# EAGLE design sensor_v0.2 (EAGLE 7.7.0)

## Sheet 1 of 2
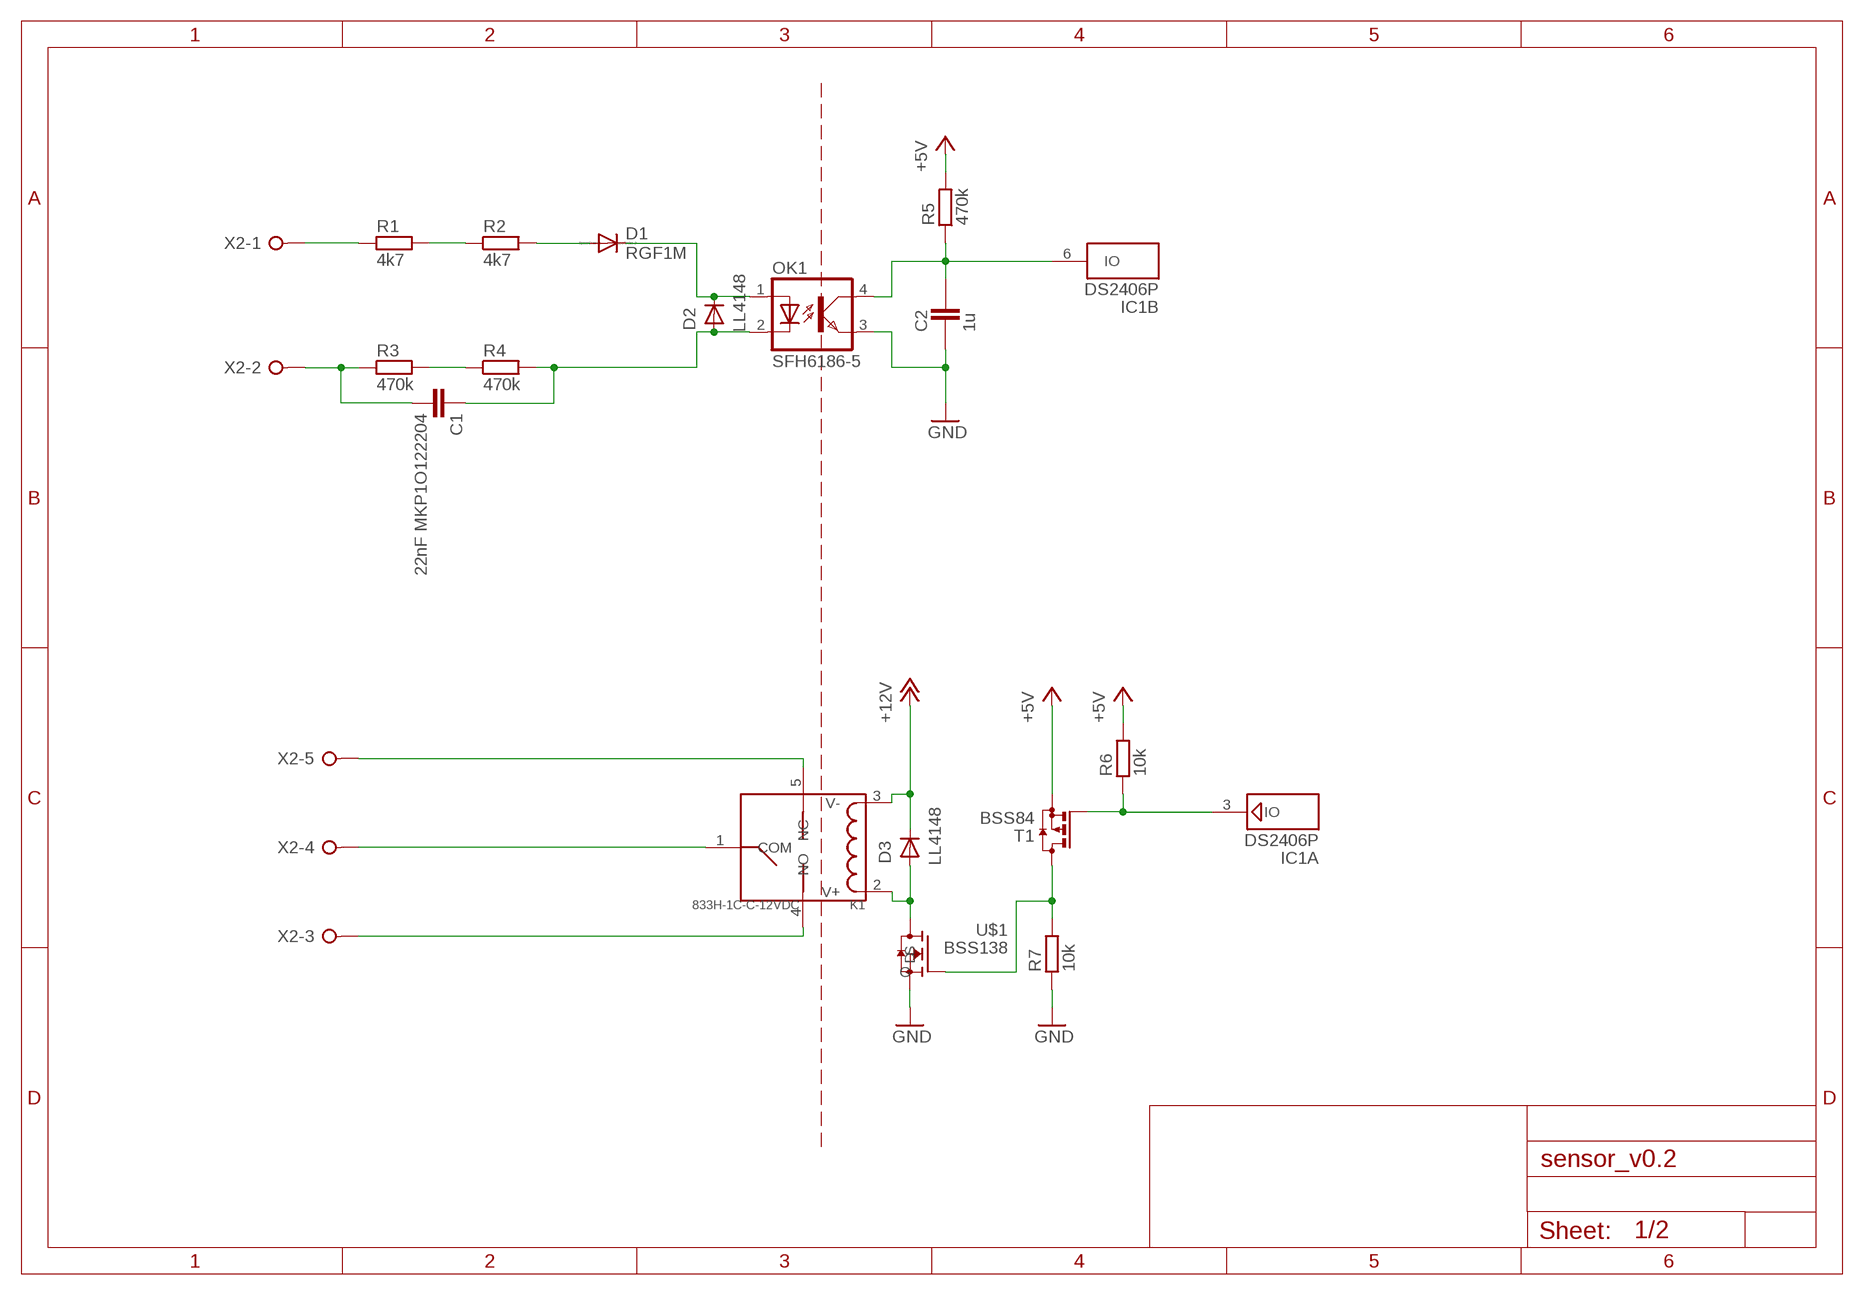
[diagram p0: schematic, sheet 1]

### Parts
C1  22nF MKP1O122204  C-EU150-064X183  [C150-064X183]
C2  1u  CAPACITOR_0603  [CAPC1608X92N]
D1  RGF1M  DIODE-DO214BA  [DO214BA]
D2  LL4148  PMLL4148L  [SOD80C]
D3  LL4148  PMLL4148L  [SOD80C]
IC1  DS2406P  [TSOC6]
K1  833H-1C-C-12VDC  RELAY-HLS8L-DC3V-S-C(5P-19X15MM)  [REY5-19.0X15.0X15.0MM]
OK1  SFH6186-5  [SMD4]
R1  4k7  RESISTOR_2512  [RESC6432X70N]
R2  4k7  RESISTOR_2512  [RESC6432X70N]
R3  470k  RESISTOR_2512  [RESC6432X70N]
R4  470k  RESISTOR_2512  [RESC6432X70N]
R5  470k  RESISTOR_0402  [RESC1005X40AN]
R6  10k  RESISTOR_0402  [RESC1005X40AN]
R7  10k  RESISTOR_0402  [RESC1005X40AN]
T1  BSS84  [SOT23]
U$1  BSS138  [BSS138]
X2  W237-05P  [W237-5P]

### Nets
!EN: IC1.3(A:IO) R6.1 T1.1(G)
!PWR: C2.2 IC1.6(B:IO) OK1.4(COL) R5.1
+5V: R5.2 R6.2 T1.2(S) ; also sheet 2
+12V: D3.1(K) K1.3(V-) ; also sheet 2
GND: C2.1 OK1.3(EMIT) R7.1 U$1.S ; also sheet 2
N$1: R1.1 X2.1
N$2: R1.2 R2.1
N$3: R3.2 R4.1
N$4: C1.2 R3.1 X2.2
N$5: D1.A R2.2
N$6: C1.1 D2.2(A) OK1.2(C) R4.2
N$7: D1.C D2.1(K) OK1.1(A)
N$8: K1.1(COM) X2.4
N$9: K1.5(NC) X2.5
N$10: K1.4(NO) X2.3
N$12: R7.2 T1.3(D) U$1.G
N$13: D3.2(A) K1.2(V+) U$1.D

## Sheet 2 of 2
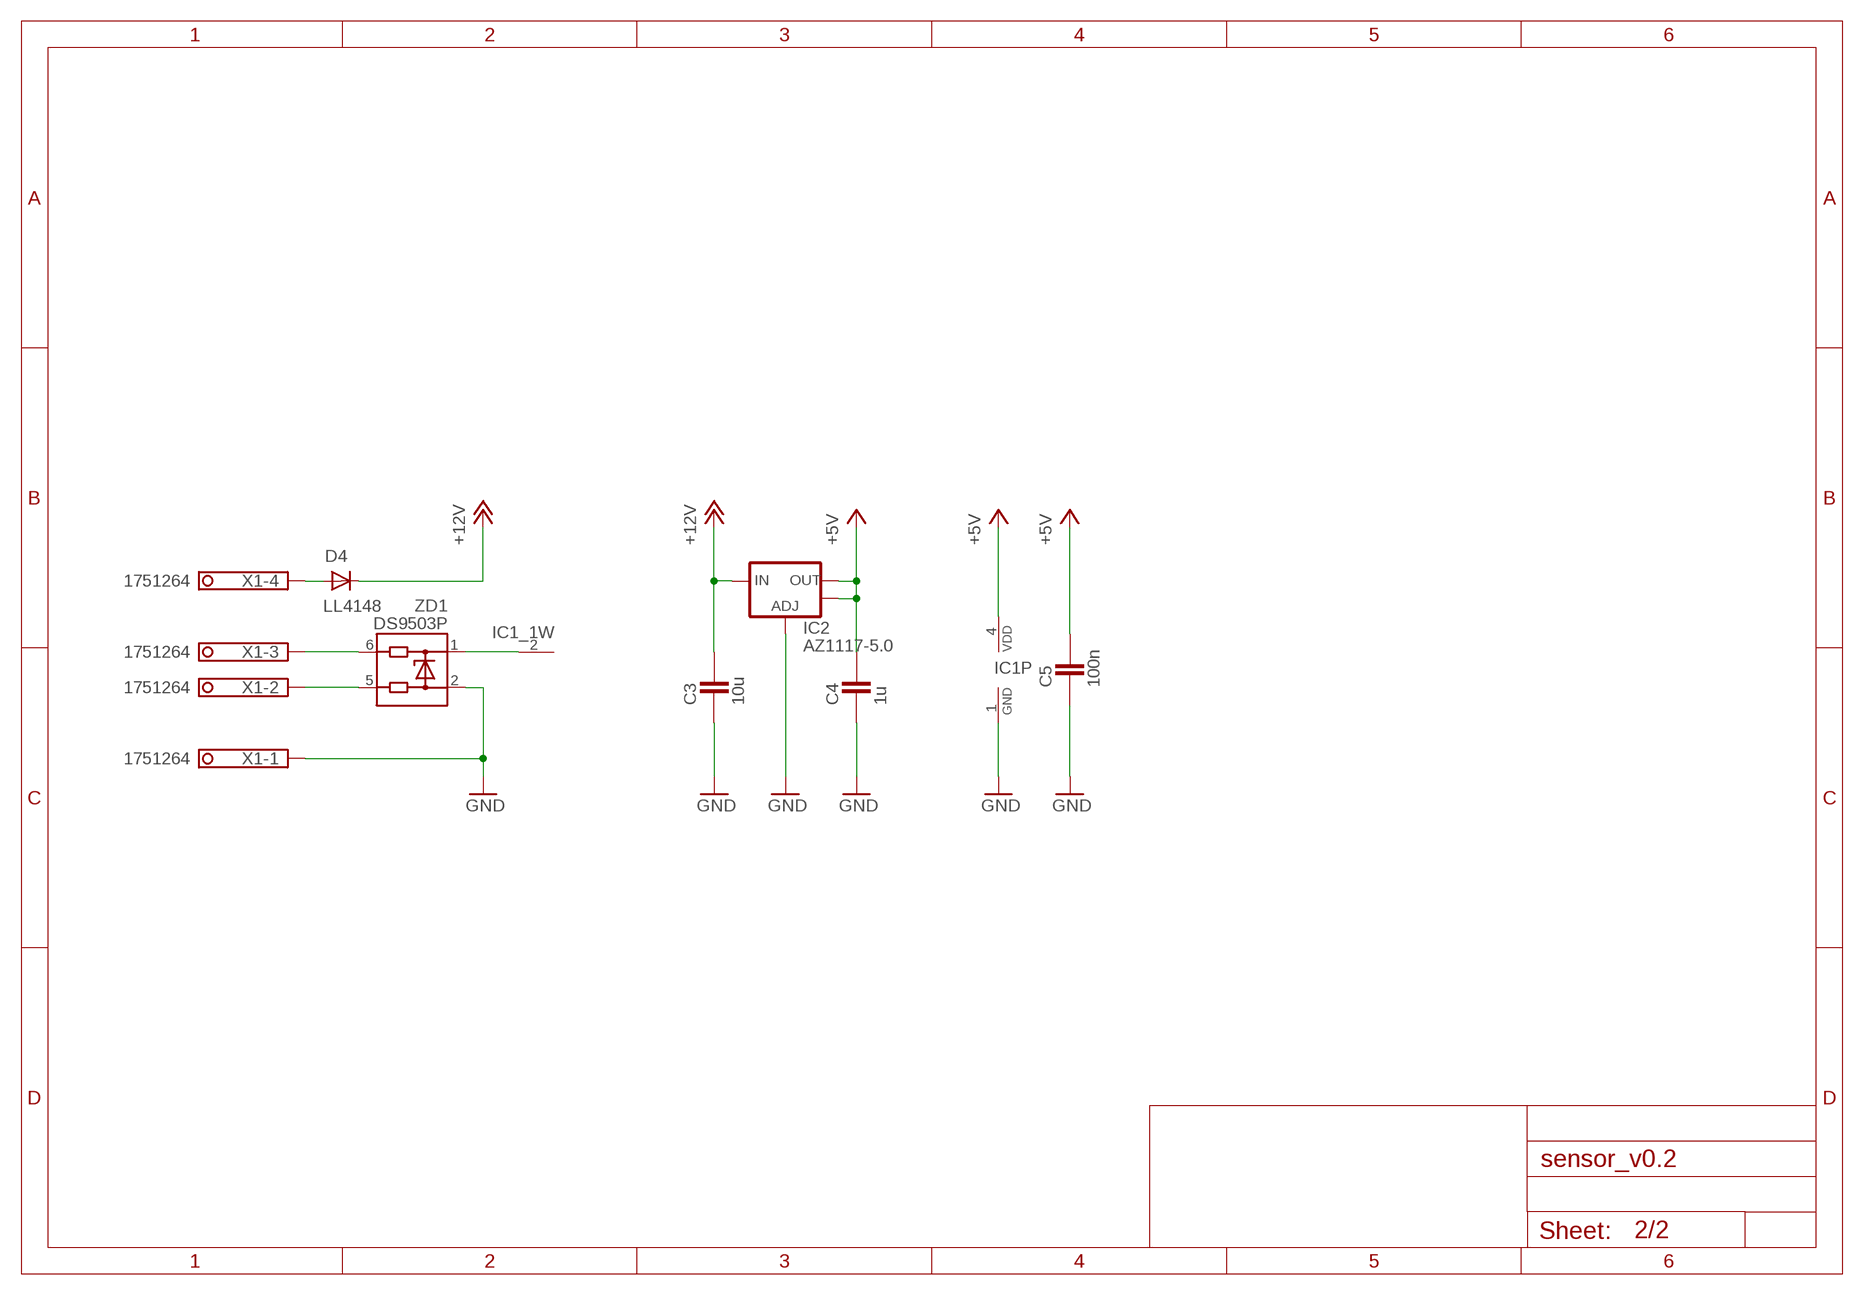
[diagram p1: schematic, sheet 2]

### Parts
C3  10u  CAPACITOR_0805  [CAPC2012X145AN]
C4  1u  CAPACITOR_0603  [CAPC1608X92N]
C5  100n  CAPACITOR_0402  [CAPC1005X60N]
D4  LL4148  PMLL4148L  [SOD80C]
IC2  AZ1117-5.0  V_REG_LM1117SOT223  [SOT223]
X1  1751264  [1751264]
ZD1  DS9503P  [TSOC6]

### Nets
1W: IC1.2(_1W:1W) ZD1.1
+5V: C4.2 C5.2 IC1.4(P:VDD) IC2.2(OUT) IC2.4(OUT) ; also sheet 1
+12V: C3.2 D4.1(K) IC2.3(IN) ; also sheet 1
GND: C3.1 C4.1 C5.1 IC1.1(P:GND) IC2.1(ADJ) X1.1 ZD1.2 ; also sheet 1
N$11: X1.2 ZD1.5
N$14: X1.3 ZD1.6
N$16: D4.2(A) X1.4

## Library data of the parts
C1 = rcl:C-EU: CAPACITOR, European symbol
C2-C5 = ipc-7351-capacitor:CAPACITOR_
D1 = diode:DIODE-: DIODE
D2-D4 = nxp_60:PMLL4148L: Single high-speed switching diodes, fabricated in planar technology, and encapsulated in small hermetically sealed glass SOD80C Surface-Mounted Device (SMD) packages. AAL Eindhoven MK; FARNELL: 1097176
IC1 = 1wire:DS2406P: Dual Addressable Switch Plus 1024-Bit EPROM This chip provides one open drain I/O pin (PA) with 50mA sinking capability and a second open drain I/O pin (PB) with 8mA sinking capability. Each I/O pin also feature an edge detector which is set by any level change on the input and reset by software. The EPROM has 4 pages of 256 bit with sparate write protection. Notes: 12V must be applied to the 1W pin in a controlled fashion to program the EPROM. This is handled by e.g. the DS2480B host adapter chip automatically. Vdd@5V may be used to save the current chip state whenever parasitic power over the 1W pin is lost. Vdd is no Vpp pin! Never connect 12V to Vdd. The DS2406 is the same chip in a TO-92 package with 3 pins only, thus missing the PB and Vdd features. Author: Jan Kandziora <jjj@gmx.de>
IC2 = SparkFun:V_REG_LM1117: Voltage Regulator LM1117 Standard adjustable voltage regulator but in SMD form. Spark Fun Electronics SKU : COM-00595
K1 = Seeed-OPL-Relay:RELAY-HLS8L-DC3V-S-C(5P-19X15MM): 315030009; MPN: HLS8L-DC3V-S-C
OK1 = optocoupler:SFH618?*: Optocoupler, Phototransistor Output, Low Input Current Source: http://www.vishay.com/docs/83673/sfh618.pdf
R1-R7 = ipc-7351-resistor:RESISTOR_
T1 = mbed-discrete:BSS84: P-CHANNEL MOS FET
U$1 = Ava:BSS138: BSS138 N-Channel Logic Level Enhancement Mode Field Effect Transistor
X1 = con-phoenix-350:1751264: MKDS 1/ 4-3,5 Printklemme Nennstrom: 10 A Bemessungsspannung: 160 V Raster: 3,5 mm Polzahl: 4 Montageart: Löten Anschlussart: Schraubanschluss Anschlussrichtung vom Leiter zur Platine: 0° Source: http://eshop.phoenixcontact.com .. 1751264.pdf; MPN: 1751264; OC_FARNELL: unknown; OC_NEWARK: 10R0934
X2 = con-wago-508:W237-05P: WAGO SREW CLAMP; OC_FARNELL: unknown; OC_NEWARK: unknown
ZD1 = 1wire:DS9503: ESD Protection Diode with Resistors This ESD protection diode is designed especially for onewire host interfaces. Unlike the DS9502, it has two additional 5Ohm resitors in the 1W and GND line. Pin 5 and 6 have to be connected to the host side, pin 1 und 2 to the network side. The 1W line is through pin 1 and 6, the GND line is through pin 2 and 5. Author: Jan Kandziora <jjj@gmx.de>

## Board
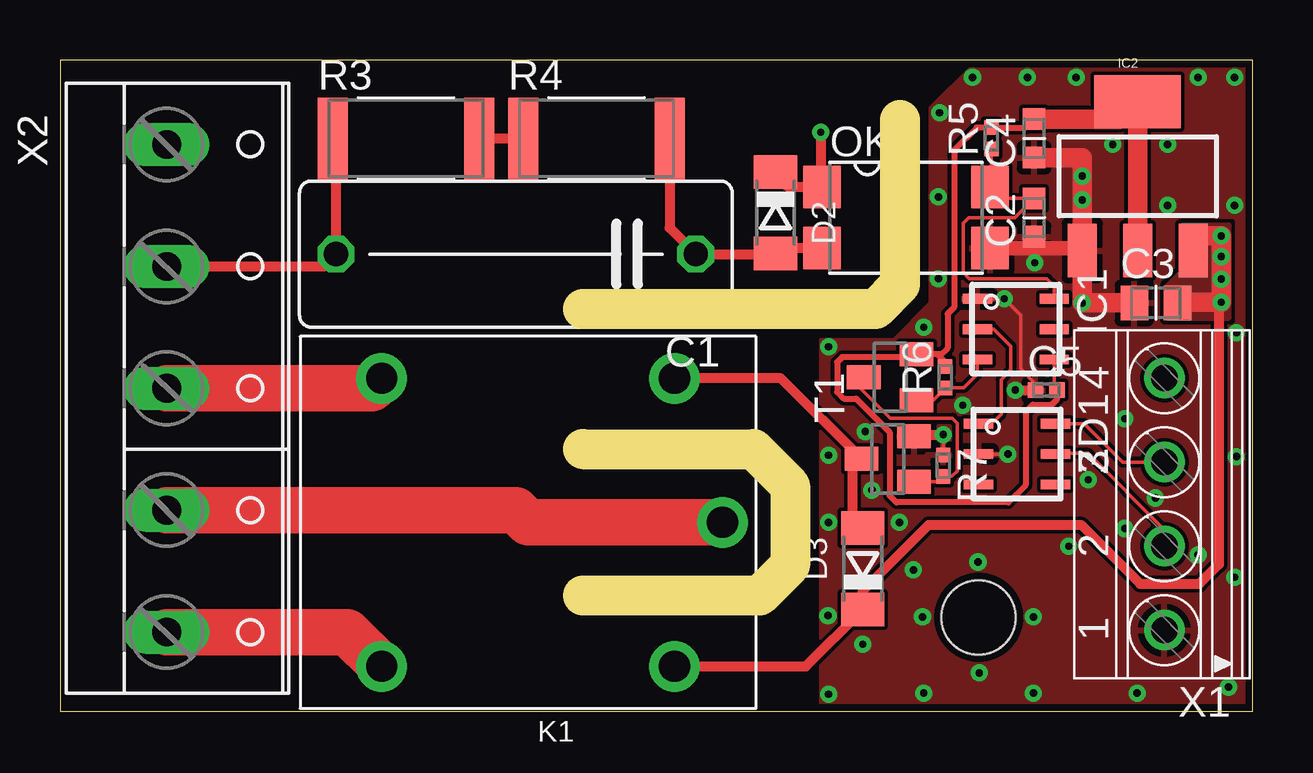
[diagram p2: board, top side]
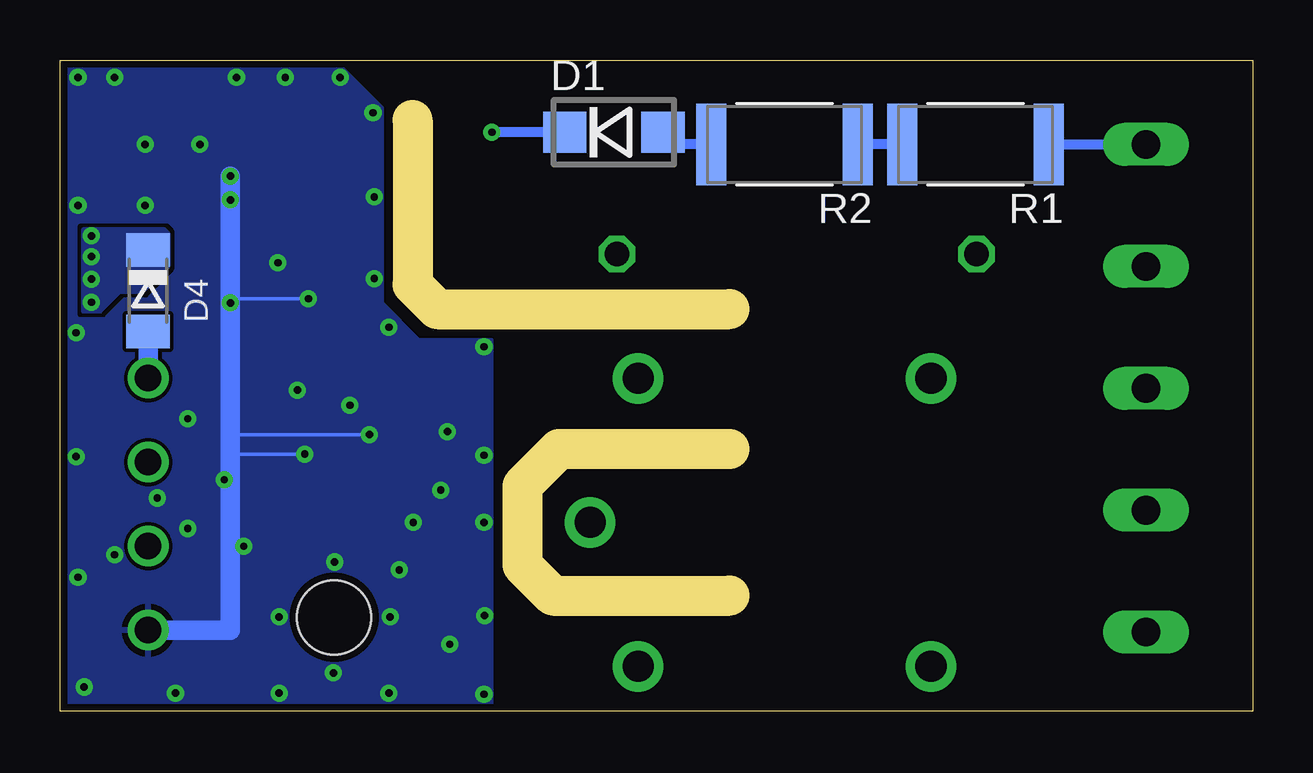
[diagram p3: board, bottom side, seen from below]

Size 49.69 x 27.14 mm. Coordinates in mm from the lower left corner, seen from the top.
Outline: 0,0 49.69,0 49.69,27.14 0,27.14 0,0
Copper layers (1*16): Top 0.035mm / dielectric 1.5mm / Bottom 0.035mm
Design rules "default *": minimum track width 6mil, minimum drill 12mil, track to track 6mil, track to pad 6mil, pad to pad 6mil, via to via 6mil, smd to smd 6mil, copper to edge 12mil, drill to drill 8mil, minimum pad ring 10mil, minimum via ring 8mil, stop-mask expansion 4mil, vias tented up to drill 20mil, thermal gap 10mil
Holes 3.1 mm at 38.27,3.91
Milling: 8 lines

### Footprints (pad centres in the part's own frame; a part is rotated, then mirrored left to right if it is on the bottom)
C150-064X183 = drill 1.016 octagon: 1 -7.493,0; 2 7.493,0
CAPC1608X92N = smd 0.9 x 0.95: 1 -0.8,0; 2 0.8,0
CAPC2012X145AN = smd 1.15 x 1.45: 1 -0.9,0; 2 0.9,0
CAPC1005X60N = smd 0.65 x 0.65: 1 -0.45,0; 2 0.45,0
DO214BA = smd 1.8 x 1.7: A 2.05,0; C -2.05,0
SOD80C = smd 1.4 x 1.8: 1 -1.7,0; 2 1.7,0
TSOC6 = smd 0.406 x 1.219: 1 -1.27,-1.6; 2 0,-1.6; 3 1.27,-1.6; 4 1.27,1.6; 5 0,1.6; 6 -1.27,1.6
SOT223 = smd 1.219 x 2.235: 1 -2.311,-3.099; 2 0,-3.099; 3 2.311,-3.099 | smd 3.6 x 2.2: 4 0,3.099
REY5-19.0X15.0X15.0MM = drill 1.3 pad 2.1: 1 -8.1,0; 2 -6.1,-6; 3 -6.1,6; 4 6.1,-6; 5 6.1,6
SMD4 = smd 1.78 x 1.55: 1 -1.27,-3.5; 2 1.27,-3.5; 3 1.27,3.5; 4 -1.27,3.5
RESC6432X70N = smd 1.25 x 3.4: 1 -3.05,0; 2 3.05,0
RESC1005X40AN = smd 0.6 x 0.6: 1 -0.45,0; 2 0.45,0
SOT23 = smd 1 x 1.4: 1 -0.95,-1.1; 2 0.95,-1.1; 3 0,1.1
BSS138 = smd 1 x 1.4: D 0,1.1; G -0.95,-1.1; S 0.95,-1.1
1751264 = drill 1.1 pad 1.7: 1 -5.25,-0.1; 2 -1.75,-0.1; 3 1.75,-0.1; 4 5.25,-0.1
W237-5P = drill 1.194 long: 1 -10.16,-0.635; 2 -5.08,-0.635; 3 0,-0.635; 4 5.08,-0.635; 5 10.16,-0.635

### Placement (x,y rotation side)
C1  19,19.05 180 top
C2  40.59,20.57 90 top
C3  45.67,17.02 0 top
C4  40.59,23.88 90 top
C5  41.09,13.39 0 top
D1  26.62,24.13 0 bottom
D2  29.82,20.78 270 top
D3  33.45,5.94 90 top
D4  46.02,17.53 270 bottom
IC1  39.82,15.93 270 top
IC2  44.9,22.3 0 top
K1  19.5,7.87 180 top
OK1  35.25,20.57 270 top
R1  11.55,23.62 180 bottom
R2  19.5,23.62 180 bottom
R3  14.42,23.88 0 top
R4  22.35,23.88 0 top
R5  38.81,23.88 90 top
R6  36.88,13.92 90 top
R7  36.8,10.24 270 top
T1  34.59,13.92 90 top
U$1  34.49,10.52 90 top
X1  45.92,8.64 90 top
X2  5.08,13.46 270 top
ZD1  39.87,10.72 270 top

### Tracks (layer width: path | path; a pad name or v marks a point on that pad's centre or on a via)
1W
  Top 0.152: IC1.2 38.91,15.93 39.62,15.21 39.62,14.22 39.21,13.82 39.21,12.37 38.94,12.09 ZD1.1
!EN
  Top 0.152: IC1.3 38.22,14.05 37.67,13.49 36.79,13.49 R6.1 36.38,12.97 T1.1
!PWR
  Top 0.152: IC1.6 41.42,17.73 41.12,18.03 37.89,18.03 37.64,18.29 37.64,20.34 37.87,20.57 39.79,20.57 C2.2 39.22,21.37 OK1.4 38.81,21.9 R5.1
+5V
  Top 0.152: IC1.4 41.42,13.51 C5.2
  Top 0.254: C5.2 41.54,13 41.32,12.78 40.54,12.78 40.23,12.47 40.23,9.42 39.52,8.71 34.85,8.71 34.57,8.99 34.57,11.63 33.17,13.03 32.66,13.03 32.38,13.31 32.38,14.55 32.59,14.76 35.48,14.76 T1.2 | 35.74,14.87 T1.2 | C4.2 40.24,24.33 R5.2 38.19,24.33 37.26,23.39 37.26,16.84 36.98,16.56 36.98,15.14 36.67,14.83 36.67,14.84 36.71,14.87 36.55,14.87 | R6.2 36.88,14.55 36.55,14.87 | 36.55,14.87 T1.2
  Top 0.813: IC2.2 IC2.4 44.13,24.68 C4.2
+12V  (via drill 0.3)
  Top 0.406: C3.2 48.28,17.02 48.28,6.12 47.47,5.31 45.01,5.31 42.54,7.77 36.19,7.77 33.45,5.03 D3.1 31.08,1.87 K1.3
  Top 0.813: C3.2 46.59,17.04 v48.38,17.04 v48.38,19.81 47.22,19.81 IC2.3
  Bottom 0.813: D4.1 46.02,19.08
  other vias: 48.38,18.95 48.38,18.01
  pour Top (no thermals): 46.78,20.24 46.78,18.34 46.12,17.68 46.12,16.41 48.69,16.41 48.69,20.24
  pour Bottom (no thermals): 45.21,19.89 45.21,18.57 45.56,18.21 46.28,17.5 47.24,17.5 48.05,16.69 48.69,16.69 48.69,20.07 47.01,20.07 45.39,20.07
GND  (via drill 0.3)
  Top 0.152: IC1.1 v39.34,17.2 40.03,16.51 40.03,14.28 40.64,13.66 C5.1 | ZD1.2 v39.49,10.72 | R7.1 v36.8,11.53
  Top 0.406: U$1.S 35.94,11.53 v36.8,11.53 | v39.8,13.39 C5.1
  Top 0.61: OK1.3 40.69,19.3 | 40.69,19.3 42.54,19.3 | 40.59,19.41 40.69,19.3
  Top 0.813: C3.1 v42.59,17.02 IC2.1 | C4.1 42.59,23.08 v42.59,22.3 v42.59,21.31 IC2.1 | 42.54,19.3 IC2.1 | C2.1 40.59,19.41
  Bottom 0.152: v39.34,17.2 42.42,17.2 v42.59,17.02 | v39.49,10.72 42.52,10.72 42.59,10.74 | v36.8,11.53 42.54,11.53 42.59,11.58
  Bottom 0.813: X1.1 42.59,3.39 42.59,10.74 42.59,11.58 v42.59,17.02 v42.59,22.3
  other vias: 35.99,16 42.34,26.42 38.02,26.42 36.65,24.94 36.6,21.44 36.6,18.03 40.31,26.42 47.42,26.42 48.94,26.42 48.94,21.08 46.15,21.08 46.15,23.62 43.86,23.62 40.56,0.76 42.03,6.88 48.69,1.02 44.88,0.76 48.94,5.59 49.02,15.77 45.64,8.89 44.37,12.19 32.03,0.71 35.99,0.76 33.45,2.79 32,3.99 32.03,10.67 32.03,7.87 32.03,15.19 44.37,7.62 34.97,7.87 42.85,9.65 49.02,10.62 33.55,11.66 33.83,9.22 35.56,5.89 38.25,6.22 40.56,3.94 38.3,1.6 35.94,3.94 47.42,6.53 40.61,18.69 37.61,12.75
  pour Top (rank 6): 38.05,26.92 36.27,25.15 36.27,17.02 34.74,15.49 31.7,15.49 31.7,0.25 49.48,0.25 49.48,26.92
  pour Bottom (rank 6): 36.27,25.15 36.27,17.02 34.74,15.49 31.7,15.49 31.7,0.25 49.48,0.25 49.48,26.92 38.05,26.92
N$1
  Bottom 0.406: R1.1 X2.1
N$2
  Bottom 0.406: R1.2 R2.1
N$3
  Top 0.406: R3.2 R4.1
N$4
  Top 0.406: X2.2 10.99,18.54 C1.2 11.5,23.75 R3.1
N$5
  Bottom 0.406: R2.2 24.06,23.62 D1.A
N$6
  Top 0.406: OK1.2 29.84,19.3 D2.2 29.59,19.05 C1.1 25.4,20.14 R4.2
N$7  (via drill 0.3)
  Top 0.406: D2.1 30.35,21.84 OK1.1 31.7,21.9 v31.7,24.13
  Bottom 0.406: D1.C v31.7,24.13
N$8
  Top 1.93: X2.4 19,8.38 19.5,7.87 K1.1
N$9
  Top 1.93: X2.5 11.98,3.3 K1.5
N$10
  Top 1.93: X2.3 12.99,13.46 K1.4
N$11
  Top 0.152: X1.2 46.02,7.57 42.85,10.74 41.55,10.74 ZD1.5
N$12
  Top 0.152: T1.3 33.39,13.42 34.59,12.22 37.18,12.22 37.39,12.01 37.39,10.01 37.16,9.79 R7.2 36.55,9.57 U$1.G
N$13
  Top 0.406: K1.2 30.04,13.87 U$1.D 33.45,10.43 33.02,10.43 33.02,8.23 33.45,7.8 D3.2
N$14
  Top 0.152: X1.3 44.27,10.39 42.67,11.99 ZD1.6
N$16
  Bottom 0.813: D4.2 X1.4

### Text on the board
bDocu: SENS | 12V | NO | 1W | COM | W- | GND | NC